# EasyEDA schematic SCH_Boat automator 2.0_2022-11-01.json
TITLE: Sheet_1; REV: 1.0; Date: 2022-09-20; Sheet: 1/1; Company: Your Company
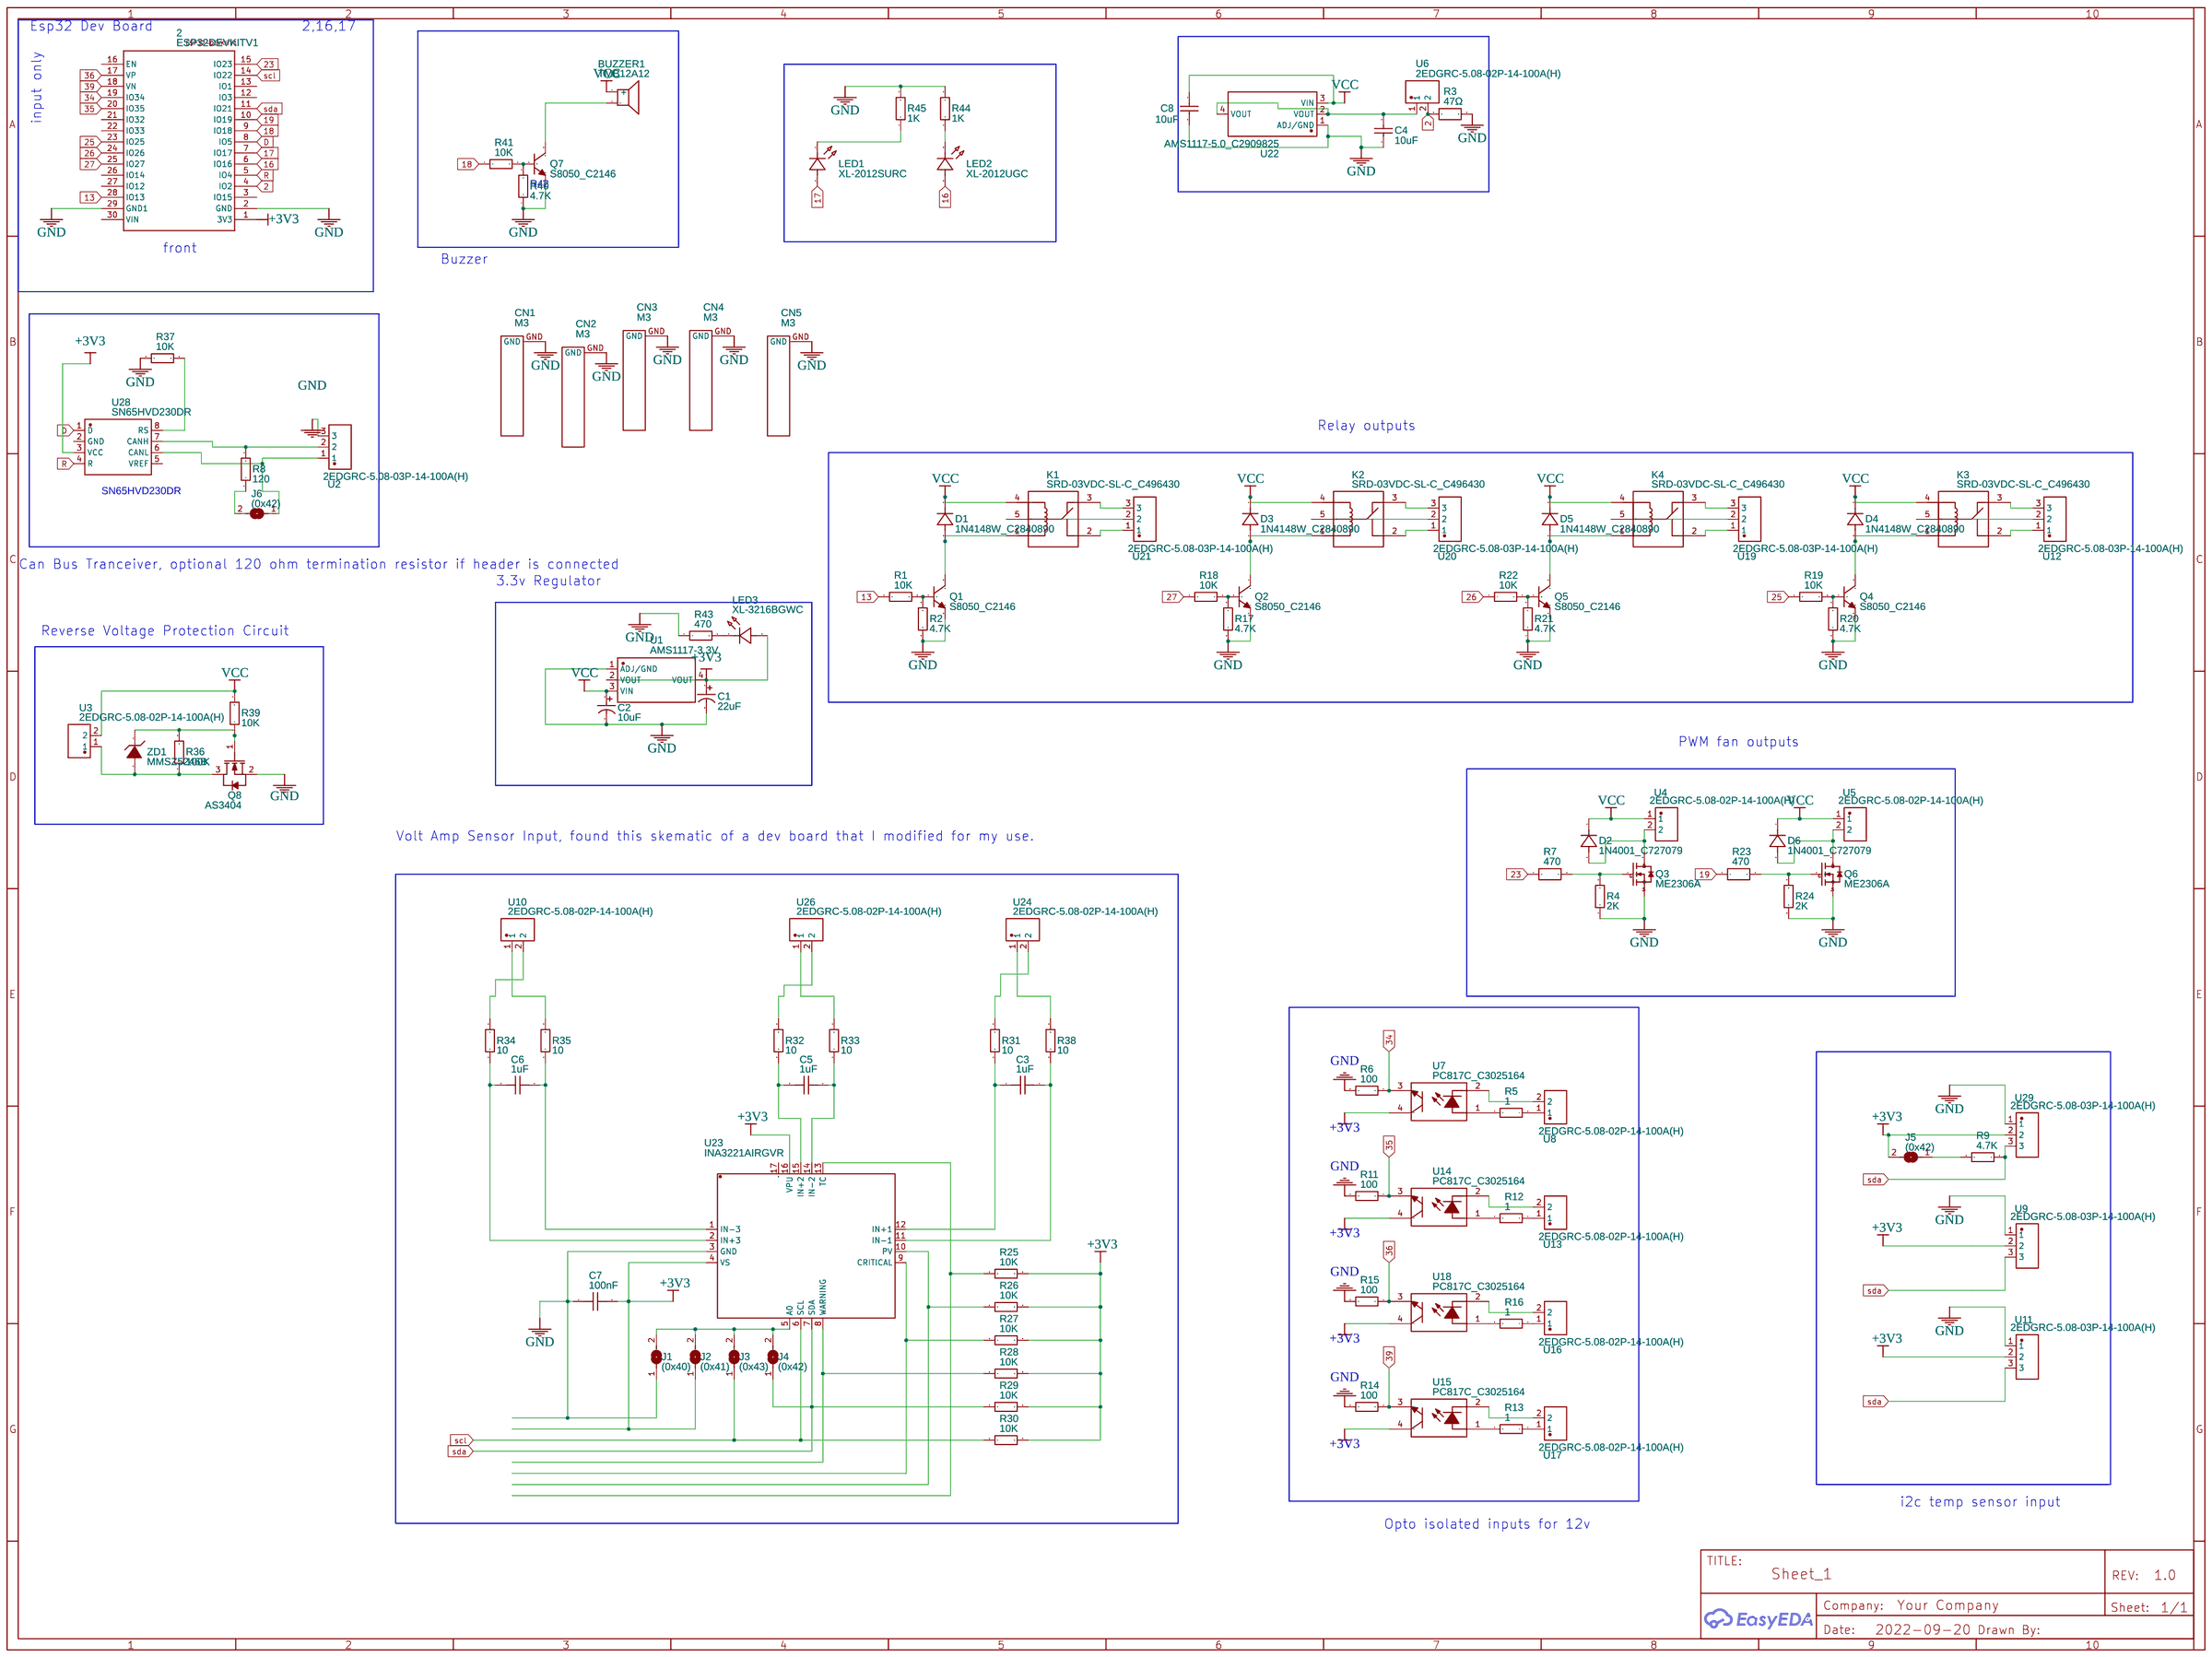
[diagram p0: schematic sheet]

## Parts
2  ESP32DEVKITV1  [ESP32-DEVKITV1]
BUZZER1  TMB12A12  [BUZ-TH_BD12.0-P7.60-D0.6-FD]
C1  22uF  [CAP-SMD_BD4.0-L4.3-W4.3-LS5.3-FD]
C2  10uF  [CAP-SMD_BD4.0-L4.3-W4.3-FD]
C3  1uF  [C0402]
C4  10uF  [C0805]
C5  1uF  [C0402]
C6  1uF  [C0402]
C7  100nF  [C0402]
C8  10uF  [C0805]
CN1  M3  [M3_SCREW]
CN2  M3  [M3_SCREW]
CN3  M3  [M3_SCREW]
CN4  M3  [M3_SCREW]
CN5  M3  [M3_SCREW]
D1  1N4148W_C2840890  [SOD-123_L2.7-W1.6-LS3.7-RD-1]
D2  1N4001_C727079  [SMA_L4.3-W2.5-LS5.0-RD]
D3  1N4148W_C2840890  [SOD-123_L2.7-W1.6-LS3.7-RD-1]
D4  1N4148W_C2840890  [SOD-123_L2.7-W1.6-LS3.7-RD-1]
D5  1N4148W_C2840890  [SOD-123_L2.7-W1.6-LS3.7-RD-1]
D6  1N4001_C727079  [SMA_L4.3-W2.5-LS5.0-RD]
J1  (0x40)  [JUMPER2-0603_NC]
J2  (0x41)  [JUMPER2-0603_NC]
J3  (0x43)  [JUMPER2-0603_NC]
J4  (0x42)  [JUMPER2-0603_NC]
J5  (0x42)  [JUMPER2-0603_NC]
J6  (0x42)  [JUMPER2-0603_NC]
K1  SRD-03VDC-SL-C_C496430  [RELAY-TH_SRD-03VDC-SL-C]
K2  SRD-03VDC-SL-C_C496430  [RELAY-TH_SRD-03VDC-SL-C]
K3  SRD-03VDC-SL-C_C496430  [RELAY-TH_SRD-03VDC-SL-C]
K4  SRD-03VDC-SL-C_C496430  [RELAY-TH_SRD-03VDC-SL-C]
LED1  XL-2012SURC  [LED0805-RD_RED]
LED2  XL-2012UGC  [LED0805-RD_GREEN]
LED3  XL-3216BGWC  [LED1206-RD_BLUE]
Q1  S8050_C2146  [SOT-23-3_L3.0-W1.7-P0.95-LS2.9-BR]
Q2  S8050_C2146  [SOT-23-3_L3.0-W1.7-P0.95-LS2.9-BR]
Q3  ME2306A  [SOT-23_L2.9-W1.3-P1.90-LS2.4-BR]
Q4  S8050_C2146  [SOT-23-3_L3.0-W1.7-P0.95-LS2.9-BR]
Q5  S8050_C2146  [SOT-23-3_L3.0-W1.7-P0.95-LS2.9-BR]
Q6  ME2306A  [SOT-23_L2.9-W1.3-P1.90-LS2.4-BR]
Q7  S8050_C2146  [SOT-23-3_L3.0-W1.7-P0.95-LS2.9-BR]
Q8  AS3404  [SOT-23_L2.9-W1.3-P1.90-LS2.4-BR]
R1  10K  [R0603]
R2  4.7K  [R0603]
R3  47Ω  [R2512]
R4  2K  [R0603]
R5  1  [R0603]
R6  100  [R0603]
R7  470  [R0402]
R8  120  [R1206]
R9  4.7K  [R0603]
R11  100  [R0603]
R12  1  [R0603]
R13  1  [R0603]
R14  100  [R0603]
R15  100  [R0603]
R16  1  [R0603]
R17  4.7K  [R0603]
R18  10K  [R0603]
R19  10K  [R0603]
R20  4.7K  [R0603]
R21  4.7K  [R0603]
R22  10K  [R0603]
R23  470  [R0402]
R24  2K  [R0603]
R25  10K  [R0603]
R26  10K  [R0603]
R27  10K  [R0603]
R28  10K  [R0603]
R29  10K  [R0603]
R30  10K  [R0603]
R31  10  [R0603]
R32  10  [R0603]
R33  10  [R0603]
R34  10  [R0603]
R35  10  [R0603]
R36  100K  [R0603]
R37  10K  [R0603]
R38  10  [R0603]
R39  10K  [R0603]
R40  4.7K  [R0603]
R41  10K  [R0603]
R43  470  [R1206]
R44  1K  [R1206]
R45  1K  [R1206]
U1  AMS1117-3.3V  [SOT-223-4_L6.5-W3.5-P2.30-LS7.0-BR]
U2  2EDGRC-5.08-03P-14-100A(H)  [CONN-TH_2EDGRC-5.08-03P-14-100A-H]
U3  2EDGRC-5.08-02P-14-100A(H)  [CONN-TH_2EDGRC-5.08-02P-14-100A-H]
U4  2EDGRC-5.08-02P-14-100A(H)  [CONN-TH_2EDGRC-5.08-02P-14-100A-H]
U5  2EDGRC-5.08-02P-14-100A(H)  [CONN-TH_2EDGRC-5.08-02P-14-100A-H]
U6  2EDGRC-5.08-02P-14-100A(H)  [CONN-TH_2EDGRC-5.08-02P-14-100A-H]
U7  PC817C_C3025164  [OPTO-SMD-4_L4.6-W6.5-P2.54-LS10.3-TL]
U8  2EDGRC-5.08-02P-14-100A(H)  [CONN-TH_2EDGRC-5.08-02P-14-100A-H]
U9  2EDGRC-5.08-03P-14-100A(H)  [CONN-TH_2EDGRC-5.08-03P-14-100A-H]
U10  2EDGRC-5.08-02P-14-100A(H)  [CONN-TH_2EDGRC-5.08-02P-14-100A-H]
U11  2EDGRC-5.08-03P-14-100A(H)  [CONN-TH_2EDGRC-5.08-03P-14-100A-H]
U12  2EDGRC-5.08-03P-14-100A(H)  [CONN-TH_2EDGRC-5.08-03P-14-100A-H]
U13  2EDGRC-5.08-02P-14-100A(H)  [CONN-TH_2EDGRC-5.08-02P-14-100A-H]
U14  PC817C_C3025164  [OPTO-SMD-4_L4.6-W6.5-P2.54-LS10.3-TL]
U15  PC817C_C3025164  [OPTO-SMD-4_L4.6-W6.5-P2.54-LS10.3-TL]
U16  2EDGRC-5.08-02P-14-100A(H)  [CONN-TH_2EDGRC-5.08-02P-14-100A-H]
U17  2EDGRC-5.08-02P-14-100A(H)  [CONN-TH_2EDGRC-5.08-02P-14-100A-H]
U18  PC817C_C3025164  [OPTO-SMD-4_L4.6-W6.5-P2.54-LS10.3-TL]
U19  2EDGRC-5.08-03P-14-100A(H)  [CONN-TH_2EDGRC-5.08-03P-14-100A-H]
U20  2EDGRC-5.08-03P-14-100A(H)  [CONN-TH_2EDGRC-5.08-03P-14-100A-H]
U21  2EDGRC-5.08-03P-14-100A(H)  [CONN-TH_2EDGRC-5.08-03P-14-100A-H]
U22  AMS1117-5.0_C2909825  [SOT-223-3_L6.5-W3.4-P2.30-LS7.0-BR]
U23  INA3221AIRGVR  [QFN-16_L4.0-W4.0-P0.65-TL-EP2.2]
U24  2EDGRC-5.08-02P-14-100A(H)  [CONN-TH_2EDGRC-5.08-02P-14-100A-H]
U26  2EDGRC-5.08-02P-14-100A(H)  [CONN-TH_2EDGRC-5.08-02P-14-100A-H]
U28  SN65HVD230DR  [SOIC-8_L4.9-W3.9-P1.27-LS6.0-BL]
U29  2EDGRC-5.08-03P-14-100A(H)  [CONN-TH_2EDGRC-5.08-03P-14-100A-H]
ZD1  MMSZ5246B  [SOD-123_L2.8-W1.8-LS3.7-RD]

## Library data of the parts
2 = ESP32DEVKITV1: Contributor: gadomer10
BUZZER1 = TMB12A12: Supplier: LCSC; Manufacturer: HNDZ; Supplier Part: C96079; JLCPCB Part Class: Extended Part; Frequency: 2300Hz
C1 = RVT1C220M0405: Supplier: LCSC; Manufacturer: ROQANG; Supplier Part: C72502; JLCPCB Part Class: Extended Part
C2 = RVT1V100M0405-C72485: Supplier: LCSC; Manufacturer: ROQANG; Manufacturer Part: RVT1V100M0405; Supplier Part: C72485; JLCPCB Part Class: Extended Part
C3 C5 C6 = CC0402KRX5R7BB105: Supplier: LCSC; Supplier Part: C325464; Manufacturer: YAGEO; Contributor: LCSC; JLCPCB Part Class: Extended Part
C4 C8 = CC0805KKX5R8BB106: Supplier: LCSC; Manufacturer: YAGEO; Supplier Part: C89831; JLCPCB Part Class: Extended Part
C7 = CC0402KRX5R6BB104: Supplier: LCSC; Supplier Part: C129131; Manufacturer: YAGEO; Contributor: LCSC; JLCPCB Part Class: Extended Part
CN1-CN5 = M3: Supplier: LCSC; Manufacturer: BOOMELE; Manufacturer Part: XH-9A; Supplier Part: C8887; Contributor: kslimmm
D1 D3-D5 = 1N4148W_C2840890: Supplier: LCSC; Supplier Part: C2840890; Manufacturer: PSI(宝力芯); Manufacturer Part: 1N4148W; JLCPCB Part Class: Extended Part; Contributor: LCSC
D2 D6 = 1N4001_C727079: Supplier: LCSC; Supplier Part: C727079; Manufacturer: TWGMC; Manufacturer Part: 1N4001; Contributor: LCSC; JLCPCB Part Class: Extended Part
J1-J6 = -: Contributor: grosseruser; Manufacturer Part: ?
K1-K4 = SRD-03VDC-SL-C_C496430: Supplier: LCSC; Supplier Part: C496430; Manufacturer: 松乐; Manufacturer Part: SRD-03VDC-SL-C; JLCPCB Part Class: Extended Part; Contributor: LCSC
LED1 = XL-2012SURC: Supplier: LCSC; Supplier Part: C965812; Manufacturer: XINGLIGHT(成兴光); JLCPCB Part Class: Extended Part; Contributor: LCSC
LED2 = XL-2012UGC: Supplier: LCSC; Supplier Part: C965815; Manufacturer: XINGLIGHT(成兴光); JLCPCB Part Class: Extended Part; Contributor: LCSC
LED3 = XL-3216BGWC: Supplier: LCSC; Supplier Part: C965829; Manufacturer: XINGLIGHT(成兴光); JLCPCB Part Class: Extended Part; Contributor: lcsc
Q1 Q2 Q4 Q5 Q7 = S8050_C2146: Supplier: LCSC; Manufacturer: CJ; Manufacturer Part: S8050; Supplier Part: C2146; JLCPCB Part Class: Basic Part
Q3 Q6 = ME2306A: Supplier: LCSC; Manufacturer: MQTSUKI; Contributor: LCSC; Supplier Part: C165219; JLCPCB Part Class: Extended Part
Q8 = AS3404: Supplier: LCSC; Supplier Part: C232278; Manufacturer: AnBon; Contributor: LCSC; JLCPCB Part Class: Extended Part
R1 R18 R19 R22 R25-R30 R37 R39 R41 = RC0603JR-0710KL: Supplier: LCSC; Manufacturer: YAGEO; Supplier Part: C99198; JLCPCB Part Class: Extended Part; Resistance: 10kΩ
R2 R9 R17 R20 R21 R40 = RC0603JR-074K7L: Supplier: LCSC; Manufacturer: YAGEO; Supplier Part: C105428; JLCPCB Part Class: Extended Part; Resistance: 4.7kΩ
R3 = CR-12JA4---47R: Supplier: LCSC; Supplier Part: C881912; Manufacturer: Viking(光颉); Contributor: LCSC; JLCPCB Part Class: Extended Part
R4 R24 = RC0603JR-072KL: Supplier: LCSC; Manufacturer: YAGEO; Supplier Part: C105581; JLCPCB Part Class: Extended Part; Resistance: 2kΩ
R5 R12 R13 R16 = RC0603FR-071RL: Supplier: LCSC; Manufacturer: YAGEO; Supplier Part: C112305; JLCPCB Part Class: Extended Part; Resistance: 1Ω
R6 R11 R14 R15 = RC0603JR-07100RL: Supplier: LCSC; Manufacturer: YAGEO; Supplier Part: C110091; JLCPCB Part Class: Extended Part; Resistance: 100Ω
R7 R23 = AC0402FR-07470RL: Supplier: LCSC; Supplier Part: C227095; Manufacturer: YAGEO; Contributor: LCSC; JLCPCB Part Class: Extended Part; Resistance: 470Ω
R8 = RC1206FR-07120RL: Supplier: LCSC; Manufacturer: YAGEO; Supplier Part: C114928; JLCPCB Part Class: Extended Part; Resistance: 120Ω
R31-R35 R38 = RC0603FR-0710RL: Supplier: LCSC; Manufacturer: YAGEO; Supplier Part: C109318; JLCPCB Part Class: Extended Part; Resistance: 10Ω
R36 = RC0603FR-07100KL: Supplier: LCSC; Supplier Part: C14675; Manufacturer: YAGEO; Contributor: LCSC; JLCPCB Part Class: Extended Part; Resistance: 100kΩ
R43 = RC1206JR-07470RL: Supplier: LCSC; Manufacturer: YAGEO; Supplier Part: C114948; JLCPCB Part Class: Extended Part; Resistance: 470Ω
R44 R45 = RC1206JR-071KL: Supplier: LCSC; Manufacturer: YAGEO; Supplier Part: C112223; JLCPCB Part Class: Extended Part; Resistance: 1kΩ
U1 = AMS1117-3.3V: Supplier: LCSC; Supplier Part: C2688239; Manufacturer: WPMtek(维攀微); Contributor: LCSC; JLCPCB Part Class: Extended Part
U2 U9 U11 U12 U19-U21 U29 = 2EDGRC-5.08-03P-14-100A(H): Supplier: LCSC; Supplier Part: C669315; Manufacturer: DEGSON; Contributor: LCSC; JLCPCB Part Class: Extended Part
U3-U6 U8 U10 U13 U16 U17 U24 U26 = 2EDGRC-5.08-02P-14-100A(H): Supplier: LCSC; Supplier Part: C669314; Manufacturer: DEGSON; Contributor: LCSC; JLCPCB Part Class: Extended Part
U7 U14 U15 U18 = PC817C_C3025164: Supplier: LCSC; Supplier Part: C3025164; Manufacturer: GOODWORK(固得沃克); Manufacturer Part: PC817C; Contributor: lcsc; JLCPCB Part Class: Extended Part
U22 = AMS1117-5.0_C2909825: Supplier: LCSC; Supplier Part: C2909825; Manufacturer: WPMtek(维攀微); Manufacturer Part: AMS1117-5.0; Contributor: LCSC; JLCPCB Part Class: Extended Part
U23 = INA3221AIRGVR: Supplier: LCSC; Supplier Part: C181255; Manufacturer: Texas Instruments; Contributor: LCSC; JLCPCB Part Class: Extended Part
U28 = SN65HVD230DR: Supplier: LCSC; Manufacturer: TI; Supplier Part: C12084; JLCPCB Part Class: Basic Part
ZD1 = MMSZ5246B: Supplier: LCSC; Manufacturer: CJ; Supplier Part: C21544; JLCPCB Part Class: Extended Part

## Nets
+3V3: 2.1(3V3) C1.1 C7.2 J2.1 J5.2 LED3.2(A) R25.2 R26.2 R27.2 R28.2 R29.2 R30.2 U1.2(VOUT) U1.4(VOUT) U7.4 U9.2 U11.2 U14.4 U15.4 U18.4 U23.4(VS) U23.16(VPU) U28.3(VCC) U29.2
GND: 2.2(GND) 2.29(GND1) C1.2 C2.2 C4.1 C7.1 C8.1 CN1.GND CN2.GND CN3.GND CN4.GND CN5.GND J1.1 Q1.2(E) Q2.2(E) Q3.2(S) Q4.2(E) Q5.2(E) Q6.2(S) Q7.2(E) Q8.2(S) R2.1 R3.2 R4.1 R6.2 R11.2 R14.2 R15.2 R17.1 R20.1 R21.1 R24.1 R37.1 R40.1 R43.1 R44.2 R45.2 U1.1(ADJ/GND) U2.3 U9.1 U11.1 U22.1(ADJ/GND) U23.3(GND) U29.1
VCC: BUZZER1.1(+) C2.1 C8.2 D1.1(K) D2.1(K) D3.1(K) D4.1(K) D5.1(K) D6.1(K) K1.4 K2.4 K3.4 K4.4 R39.2 U1.3(VIN) U3.2 U4.1 U5.1 U22.3(VIN)
2: 2.4(IO2) R3.1 U6.2
13: 2.28(IO13) R1.1
16: 2.6(IO16) LED2.2(A)
17: 2.7(IO17) LED1.2(A)
18: 2.9(IO18) R41.1
19: 2.10(IO19) R23.1
23: 2.15(IO23) R7.1
25: 2.23(IO25) R19.1
26: 2.24(IO26) R22.1
27: 2.25(IO27) R18.1
34: 2.19(IO34) R6.1 U7.3
35: 2.20(IO35) R11.1 U14.3
36: 2.17(VP) R15.1 U18.3
39: 2.18(VN) R14.1 U15.3
D: 2.8(IO5) U28.1(D)
R: 2.5(IO4) U28.4(R)
scl: 2.14(IO22) J3.1 R30.1 U23.6(SCL)
sda: 2.11(IO21) J4.1 R9.1 R29.1 U9.3 U11.3 U23.7(SDA) U29.3
Net-(BUZZER1-2): BUZZER1.2 Q7.3(C)
Net-(C3-1): C3.1 R38.1 U23.11(IN-1)
Net-(C3-2): C3.2 R31.1 U23.12(IN+1)
Net-(C4-2): C4.2 U6.1 U22.2(VOUT) U22.4(VOUT)
Net-(C5-1): C5.1 R33.1 U23.14(IN-2)
Net-(C5-2): C5.2 R32.1 U23.15(IN+2)
Net-(C6-1): C6.1 R35.1 U23.1(IN-3)
Net-(C6-2): C6.2 R34.1 U23.2(IN+3)
Net-(D1-2): D1.2(A) K1.1 Q1.3(C)
Net-(D2-2): D2.2(A) Q3.3(D) U4.2
Net-(D3-2): D3.2(A) K2.1 Q2.3(C)
Net-(D4-2): D4.2(A) K3.1 Q4.3(C)
Net-(D5-2): D5.2(A) K4.1 Q5.3(C)
Net-(D6-2): D6.2(A) Q6.3(D) U5.2
Net-(J1-2): J1.2 J2.2 J3.2 J4.2 U23.5(A0)
Net-(J5-1): J5.1 R9.2
Net-(J6-1): J6.1 U2.1 U28.6(CANL)
Net-(J6-2): J6.2 R8.1
Net-(K1-2): K1.2 U21.1
Net-(K1-3): K1.3 U21.3
Net-(K1-5): K1.5 U21.2
Net-(K2-2): K2.2 U20.1
Net-(K2-3): K2.3 U20.3
Net-(K2-5): K2.5 U20.2
Net-(K3-2): K3.2 U12.1
Net-(K3-3): K3.3 U12.3
Net-(K3-5): K3.5 U12.2
Net-(K4-2): K4.2 U19.1
Net-(K4-3): K4.3 U19.3
Net-(K4-5): K4.5 U19.2
Net-(LED1-1): LED1.1(K) R45.1
Net-(LED2-1): LED2.1(K) R44.1
Net-(LED3-1): LED3.1(K) R43.2
Net-(Q1-1): Q1.1(B) R1.2 R2.2
Net-(Q2-1): Q2.1(B) R17.2 R18.2
Net-(Q3-1): Q3.1(G) R4.2 R7.2
Net-(Q4-1): Q4.1(B) R19.2 R20.2
Net-(Q5-1): Q5.1(B) R21.2 R22.2
Net-(Q6-1): Q6.1(G) R23.2 R24.2
Net-(Q7-1): Q7.1(B) R40.2 R41.2
Net-(Q8-1): Q8.1(G) R36.2 R39.1 ZD1.1(K)
Net-(Q8-3): Q8.3(D) R36.1 U3.1 ZD1.2(A)
Net-(R5-1): R5.1 U8.1
Net-(R5-2): R5.2 U7.1
Net-(R8-2): R8.2 U2.2 U28.7(CANH)
Net-(R12-1): R12.1 U13.1
Net-(R12-2): R12.2 U14.1
Net-(R13-1): R13.1 U17.1
Net-(R13-2): R13.2 U15.1
Net-(R16-1): R16.1 U16.1
Net-(R16-2): R16.2 U18.1
Net-(R25-1): R25.1 U23.13(TC)
Net-(R26-1): R26.1 U23.10(PV)
Net-(R27-1): R27.1 U23.9(CRITICAL)
Net-(R28-1): R28.1 U23.8(WARNING)
Net-(R31-2): R31.2 U24.2
Net-(R32-2): R32.2 U26.2
Net-(R33-2): R33.2 U26.1
Net-(R34-2): R34.2 U10.2
Net-(R35-2): R35.2 U10.1
Net-(R37-2): R37.2 U28.8(RS)
Net-(R38-2): R38.2 U24.1
Net-(U7-2): U7.2 U8.2
Net-(U13-2): U13.2 U14.2
Net-(U15-2): U15.2 U17.2
Net-(U16-2): U16.2 U18.2

Not connected (* = marked no-connect by the designer): 2 3(IO15) 12(IO3) 13(IO1) 16(EN) 21(IO32) 22(IO33) 26(IO14) 27(IO12) 30(VIN); U23 17(PAD); U28 2(GND) 5(VREF)

## Notes on the sheet
- Esp32 Dev Board
- 2,16,17
- input only
- R42
- front
- Buzzer
- Relay outputs
- SN65HVD230DR
- Can Bus Tranceiver, optional 120 ohm termination resistor if header is connected
- 3.3v Regulator
- Reverse Voltage Protection Circuit
- PWM fan outputs
- Volt Amp Sensor Input, found this skematic of a dev board that I modified for my use.
- i2c temp sensor input
- Opto isolated inputs for 12v
